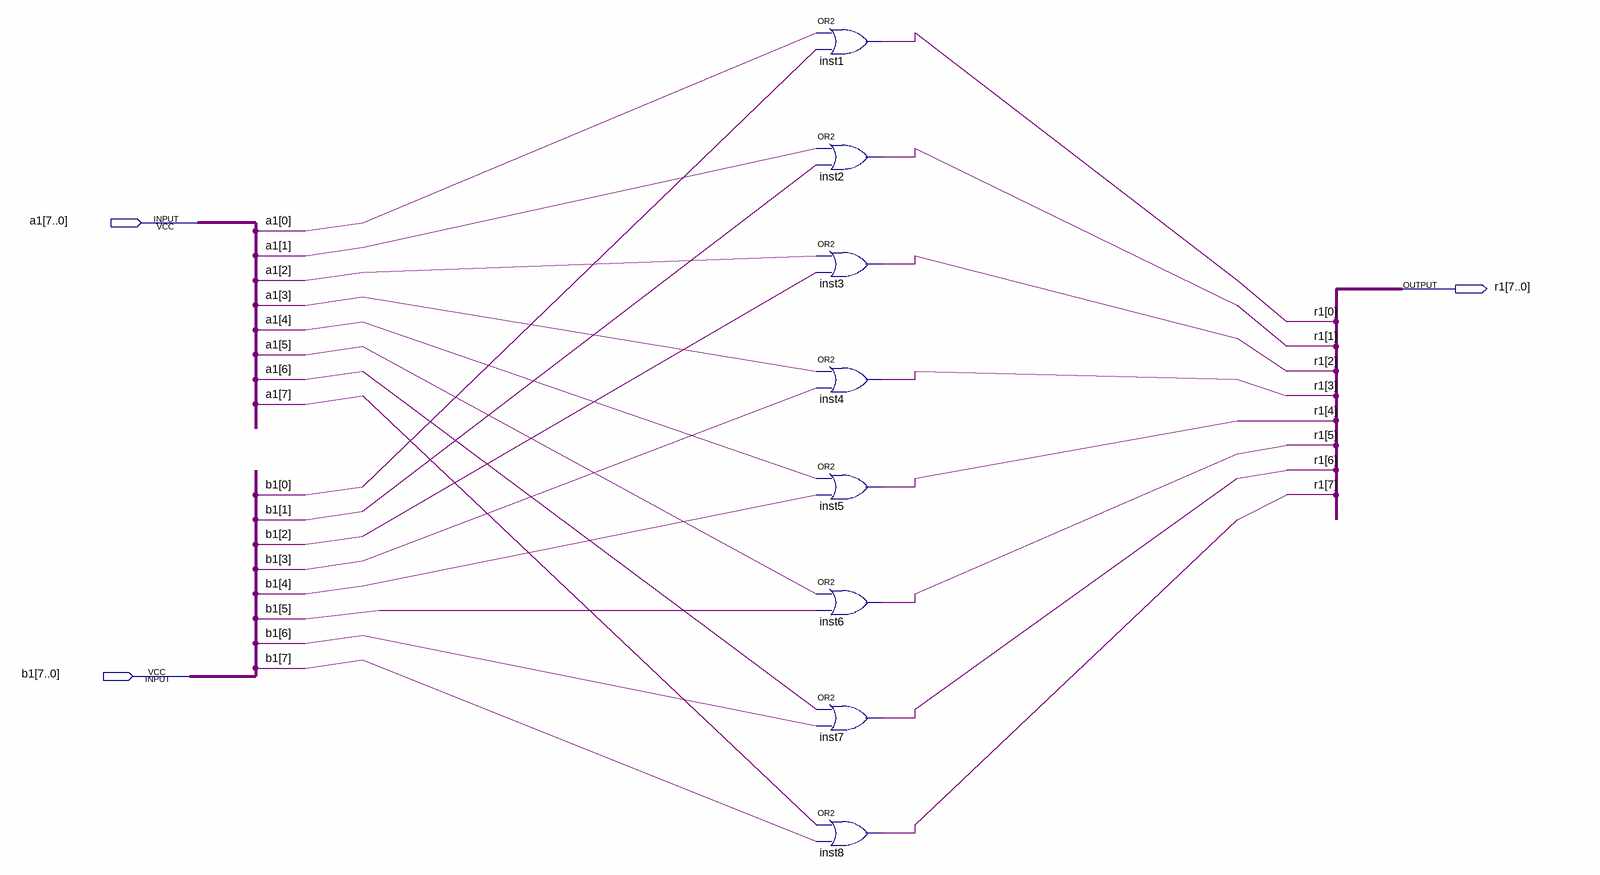
[diagram p0: schematic sheet]
// Quartus schematic or_completo.bdf as structural Verilog: 8 symbols, 3 pins
module or_completo (
  input  [7:0] a1,
  input  [7:0] b1,
  output [7:0] r1
);

  or inst1 (r1[0], a1[0], b1[0]);
  or inst2 (r1[1], a1[1], b1[1]);
  or inst3 (r1[2], a1[2], b1[2]);
  or inst4 (r1[3], a1[3], b1[3]);
  or inst5 (r1[4], a1[4], b1[4]);
  or inst6 (r1[5], a1[5], b1[5]);
  or inst7 (r1[6], a1[6], b1[6]);
  or inst8 (r1[7], a1[7], b1[7]);
endmodule
